# Altium schematic sheet GILBERT.SchDoc
size C; SheetNumber: 1; SheetTotal: 1
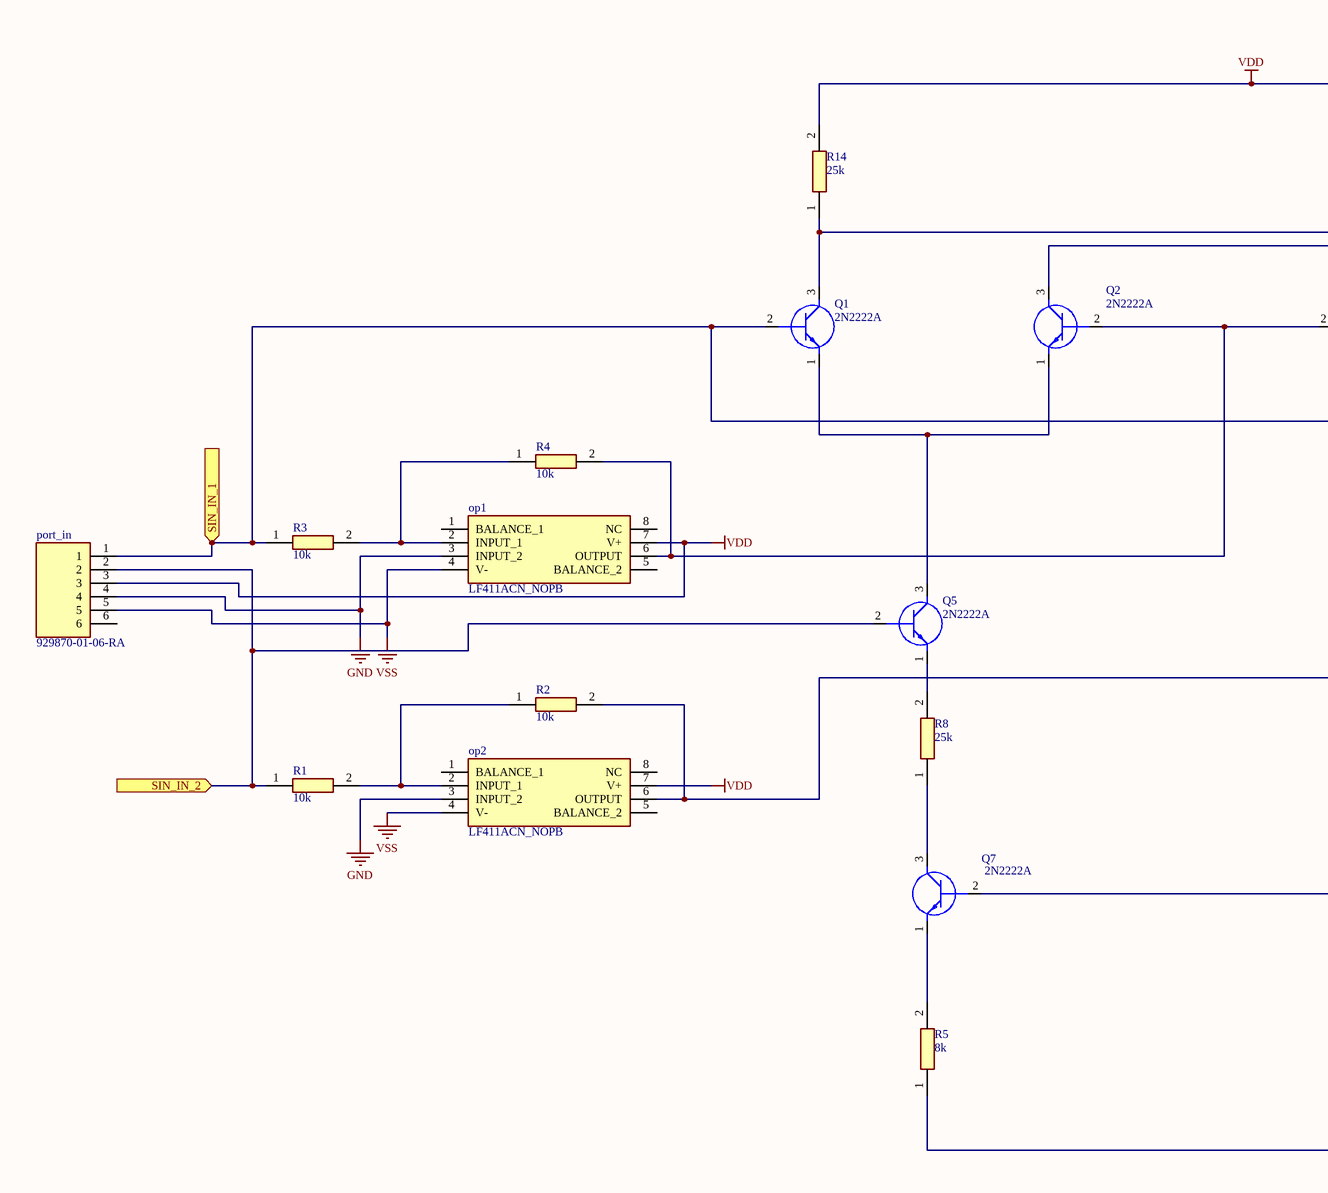
[diagram p0: GILBERT.SchDoc, left]
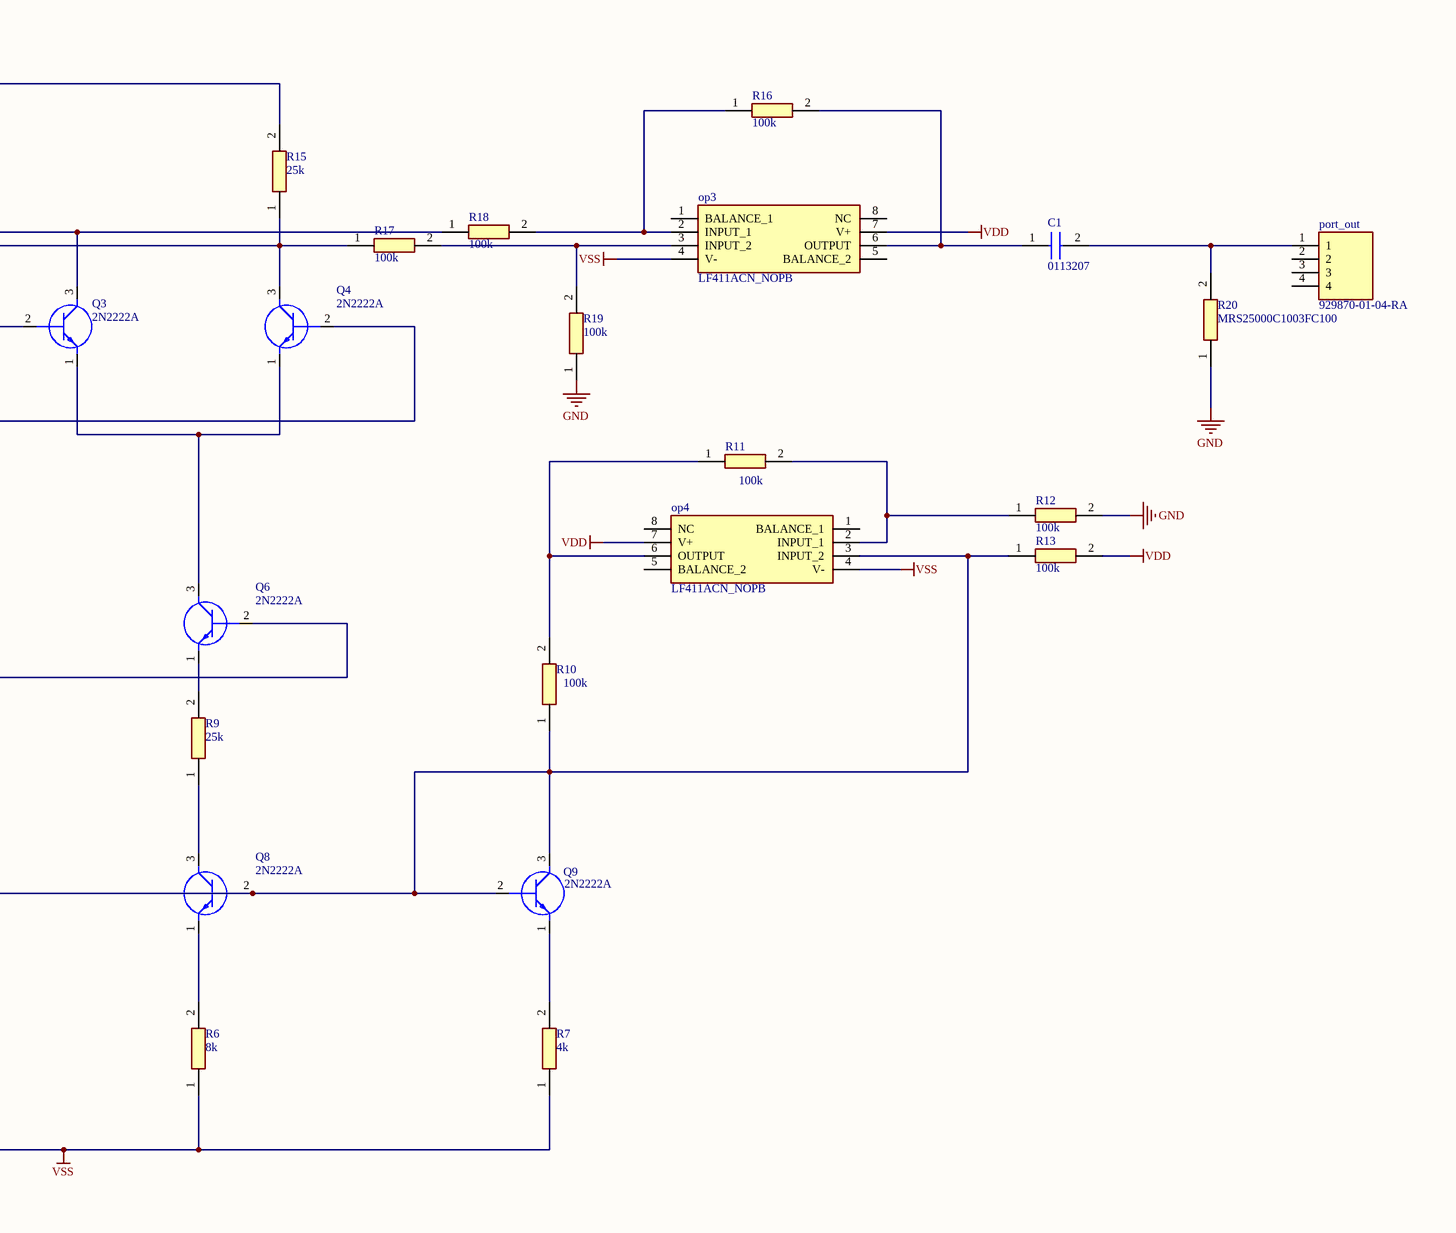
[diagram p1: GILBERT.SchDoc, right]

## Parts
C1  0113207  [CAPPA2400W30L800D400]
op1  LF411ACN_NOPB  [DIP794W53P254L959H508Q8N]
op2  LF411ACN_NOPB  [DIP794W53P254L959H508Q8N]
op3  LF411ACN_NOPB  [DIP794W53P254L959H508Q8N]
op4  LF411ACN_NOPB  [DIP794W53P254L959H508Q8N]
port_in  929870-01-06-RA  [RHDR6W64P0X254_1X6_1524X254X380P]
port_out  929870-01-04-RA  [RHDR4W76P0X254_1X4_1016X254X826P]
Q1  2N2222A  [CENTRAL_TO18]
Q2  2N2222A  [CENTRAL_TO18]
Q3  2N2222A  [CENTRAL_TO18]
Q4  2N2222A  [CENTRAL_TO18]
Q5  2N2222A  [CENTRAL_TO18]
Q6  2N2222A  [CENTRAL_TO18]
Q7  2N2222A  [CENTRAL_TO18]
Q8  2N2222A  [CENTRAL_TO18]
Q9  2N2222A  [CENTRAL_TO18]
R1  10k  [RESAD1650W60L650D250]
R2  10k  [RESAD1650W60L650D250]
R3  10k  [RESAD1650W60L650D250]
R4  10k  [RESAD1650W60L650D250]
R5  8k  [RESAD1650W60L650D250]
R6  8k  [RESAD1650W60L650D250]
R7  4k  [RESAD1650W60L650D250]
R8  25k  [RESAD1650W60L650D250]
R9  25k  [RESAD1650W60L650D250]
R10  100k  [RESAD1650W60L650D250]
R11  100k  [RESAD1650W60L650D250]
R12  100k  [RESAD1650W60L650D250]
R13  100k  [RESAD1650W60L650D250]
R14  25k  [RESAD1650W60L650D250]
R15  25k  [RESAD1650W60L650D250]
R16  100k  [RESAD1650W60L650D250]
R17  100k  [RESAD1650W60L650D250]
R18  100k  [RESAD1650W60L650D250]
R19  100k  [RESAD1650W60L650D250]
R20  MRS25000C1003FC100  [RESAD1650W60L650D250]

## Ports
SIN_IN_1 (in), SIN_IN_2 (in)

## Nets
GND: op1.3(INPUT_2) op2.3(INPUT_2) port_in.4 R12.2 R19.1 R20.1
VDD: op1.7(V+) op2.7(V+) op3.7(V+) op4.7(V+) port_in.3 R13.2 R14.2 R15.2
VSS: op1.4(V-) op2.4(V-) op3.4(V-) op4.4(V-) port_in.5 R5.1 R6.1 R7.1
SIN_IN_1: port_in.1 Q1.2(B) Q4.2(B) R3.1 ; port SIN_IN_1
SIN_IN_2: port_in.2 Q5.2(B) R1.1 ; port SIN_IN_2
NetC1_1: C1.1(+) op3.6(OUTPUT) R16.2
NetC1_2: C1.2(-) port_out.1 R20.2
Netop1_2: op1.2(INPUT_1) R3.2 R4.1
Netop1_6: op1.6(OUTPUT) Q2.2(B) Q3.2(B) R4.2
Netop2_2: op2.2(INPUT_1) R1.2 R2.1
Netop2_6: op2.6(OUTPUT) Q6.2(B) R2.2
Netop3_2: op3.2(INPUT_1) R16.1 R18.2
Netop3_3: op3.3(INPUT_2) R17.2 R19.2
Netop4_2: op4.2(INPUT_1) R11.2 R12.1
Netop4_3: op4.3(INPUT_2) Q7.2(B) Q8.2(B) Q9.2(B) Q9.3(C) R10.1 R13.1
Netop4_6: op4.6(OUTPUT) R10.2 R11.1
NetQ1_1: Q1.1(E) Q2.1(E) Q5.3(C)
NetQ1_3: Q1.3(C) Q3.3(C) R14.1 R18.1
NetQ2_3: Q2.3(C) Q4.3(C) R15.1 R17.1
NetQ3_1: Q3.1(E) Q4.1(E) Q6.3(C)
NetQ5_1: Q5.1(E) R8.2
NetQ6_1: Q6.1(E) R9.2
NetQ7_1: Q7.1(E) R5.2
NetQ7_3: Q7.3(C) R8.1
NetQ8_1: Q8.1(E) R6.2
NetQ8_3: Q8.3(C) R9.1
NetQ9_1: Q9.1(E) R7.2

Not connected (* = marked no-connect by the designer): op1 1(BALANCE_1) 5(BALANCE_2) 8(NC); op2 1(BALANCE_1) 5(BALANCE_2) 8(NC); op3 1(BALANCE_1) 5(BALANCE_2) 8(NC); op4 1(BALANCE_1) 5(BALANCE_2) 8(NC); port_in 6; port_out 2 3 4

## Library data of the parts
C1 = 0113207: Capacitor; Manufacturer_Name: RS Pro; Datasheet Link: https://docs.rs-online.com/d68c/0900766b8157e121.pdf; Manufacturer_Part_Number: 0113207
op1-op4 = LF411ACN_NOPB: Integrated Circuit; Manufacturer_Name: Texas Instruments; Manufacturer_Part_Number: LF411ACN/NOPB; Datasheet Link: https://www.allaboutcircuits.com/electronic-components/datasheet/LF411ACN%2FNOPB--Texas-Instruments/; Height: 5.08mm; Mouser Part Number: 926-LF411ACN/NOPB; Mouser Price/Stock: https://www.mouser.co.uk/ProductDetail/Texas-Instruments/LF411ACN-NOPB?qs=X1J7HmVL2ZHTi9IUrVme4Q%3D%3D; Arrow Part Number: LF411ACN/NOPB; Arrow Price/Stock: https://www.arrow.com/en/products/lf411acnnopb/texas-instruments
port_in = 929870-01-06-RA: Connector; Manufacturer_Name: 3M; Datasheet Link: https://componentsearchengine.com/Datasheets/1/929870-01-06-RA.pdf; Height: 3.8mm; Manufacturer_Part_Number: 929870-01-06-RA; Mouser Part Number: 517-929870-01-06-RA; Mouser Price/Stock: https://www.mouser.co.uk/ProductDetail/3M-Electronic-Solutions-Division/929870-01-06-RA?qs=neFkstNq%252B6F6Q7pF8hOFFA%3D%3D; Arrow Part Number: 929870-01-06-RA; Arrow Price/Stock: https://www.arrow.com/en/products/929870-01-06-ra/3m?region=nac
port_out = 929870-01-04-RA: Connector; Manufacturer_Name: 3M; Datasheet Link: https://componentsearchengine.com/Datasheets/2/929870-01-04-RA.pdf; Height: 8.26mm; Manufacturer_Part_Number: 929870-01-04-RA; Mouser Part Number: 517-929870-01-04-RA; Mouser Price/Stock: https://www.mouser.co.uk/ProductDetail/3M-Electronic-Solutions-Division/929870-01-04-RA?qs=neFkstNq%252B6GPZEKactAgTg%3D%3D; Arrow Part Number: 929870-01-04-RA; Arrow Price/Stock: https://www.arrow.com/en/products/929870-01-04-ra/3m
Q1-Q9 = 2N2222A: Transistor BJT NPN; Manufacturer_Name: Central Semiconductor; Datasheet Link: https://my.centralsemi.com/get_document.php?cmp=1&mergetype=pd&mergepath=pd&pdf_id=2N2221A.PDF; Manufacturer_Part_Number: 2N2222A; Mouser Part Number: 610-2N2222A; Mouser Price/Stock: https://www.mouser.com/Search/Refine.aspx?Keyword=610-2N2222A; Arrow Part Number: 2N2222A; Arrow Price/Stock: https://www.arrow.com/en/products/2n2222a/central-semiconductor?utm_currency=USD&region=nac
R1-R20 = MRS25000C1003FC100: Resistor; Manufacturer_Name: Vishay; Datasheet Link: http://www.vishay.com/docs/28724/mrs16m25.pdf; Manufacturer_Part_Number: MRS25000C1003FC100; Mouser Part Number: 594-MRS25000C1003FC1; Mouser Price/Stock: https://www.mouser.co.uk/ProductDetail/Vishay-BC-Components/MRS25000C1003FC100?qs=H30XFsNYD%2FHyk6mBpuomxg%3D%3D; Arrow Part Number: MRS25000C1003FC100; Arrow Price/Stock: https://www.arrow.com/en/products/mrs25000c1003fc100/vishay?region=nac